# EAGLE design BRD170321 (EAGLE 7.6.0)
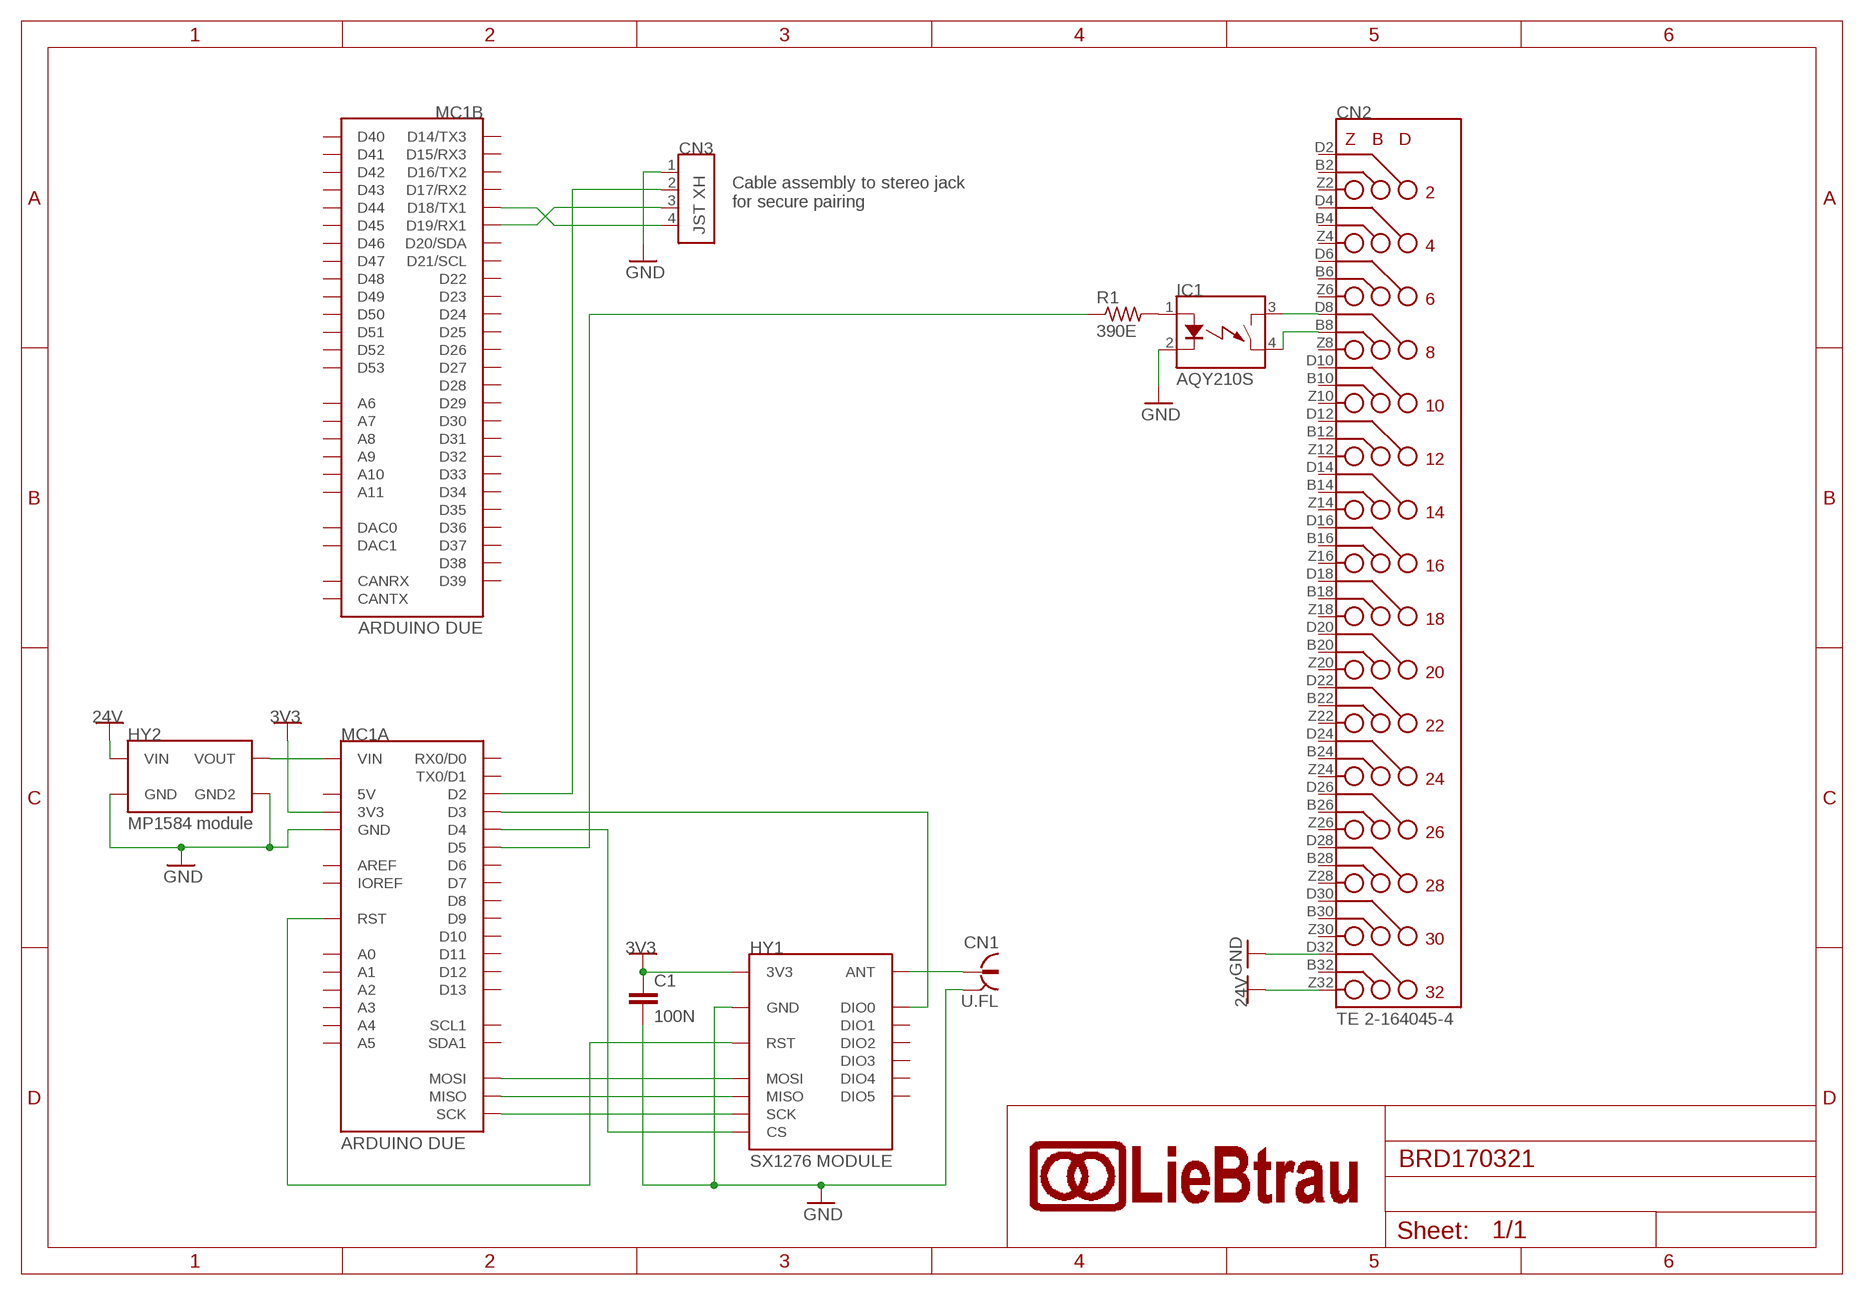
[diagram p0: schematic, sheet 1]
U$1 (SY_FRAMEA4): REV: R00.0x; TITLE: Garage controller

## Parts
C1  100N  CA_100N_1206  [CA_1206]
CN1  U.FL  CN_COAX_UMC_IPEX_U.FL_MALE  [CN_RF_U.FL_MALE]
CN2  TE 2-164045-4  CN_DIN41612F_HDR_90D_  [CN_HDR_DIN41612F_90D]
CN3  JST XH  CN_4P_JST_B4B-XH_JST_B4B-XH  [CN_HDR_1X4_180D_P25_JST_B4B-XH]
HY1  SX1276 MODULE  HY_SX1276  [HY_SX1276]
HY2  MP1584 module  HY_DCDC_MP1584_MP1584  [HY_MP1584]
IC1  AQY210S  IC_RELAY_SSR_NO_AQY210SX_SO6_4  [SC_SO6_P4]
MC1  ARDUINO DUE  MC_ARDUINO_DUE  [MC_ARDUINO_DUE]
R1  390E  RE_390E_1206  [RE_1206]

## Nets
3V3: C1.1 HY1.VCC(3V3) MC1.3.3V(A:3V3)
24V: CN2.Z32(32Z) HY2.IN+(VIN)
GND: C1.2 CN1.2A(OUTER) CN1.2B(OUTER) CN2.D32(32D) CN3.1 HY1.GND HY1.GND@1(GND) HY1.GND@2(GND) HY2.IN-(GND) HY2.OUT-(GND2) IC1.2(C) MC1.GND@1(A:GND) MC1.GND@2(A:GND) MC1.GND@3(A:GND) MC1.GND@4(A:GND) MC1.GND@5(A:GND) MC1.GND@6(A:GND)
N$1: IC1.1(A) R1.2
N$2: CN1.1(INNER) HY1.ANT
N$3: HY1.MOSI MC1.MOSI(A:MOSI)
N$4: HY2.OUT+(VOUT) MC1.VIN(A:VIN)
N$5: CN2.D8(8D) IC1.3(D1)
N$6: CN2.B8(8B) IC1.4(D2)
N$7: MC1.5(A:D5) R1.1
N$8: HY1.MISO MC1.MISO(A:MISO)
N$9: HY1.SCK MC1.SCK(A:SCK)
N$10: HY1.NSS(CS) MC1.4(A:D4)
N$11: HY1.DIO0 MC1.3(A:D3)
N$12: HY1.REST(RST) MC1.RESET(A:RST) MC1.RESET@2(A:RST)
N$13: CN3.2 MC1.2(A:D2)
N$14: CN3.3 MC1.19(B:D19/RX1)
N$15: CN3.4 MC1.18(B:D18/TX1)
Unconnected: CN2.B2(2B) CN2.B4(4B) CN2.B6(6B) CN2.B10(10B) CN2.B12(12B) CN2.B14(14B) CN2.B16(16B) CN2.B18(18B) CN2.B20(20B) CN2.B22(22B) CN2.B24(24B) CN2.B26(26B) CN2.B28(28B) CN2.B30(30B) CN2.B32(32B) CN2.D2(2D) CN2.D4(4D) CN2.D6(6D) CN2.D10(10D) CN2.D12(12D) CN2.D14(14D) CN2.D16(16D) CN2.D18(18D) CN2.D20(20D) CN2.D22(22D) CN2.D24(24D) CN2.D26(26D) CN2.D28(28D) CN2.D30(30D) CN2.Z2(2Z) CN2.Z4(4Z) CN2.Z6(6Z) CN2.Z8(8Z) CN2.Z10(10Z) CN2.Z12(12Z) CN2.Z14(14Z) CN2.Z16(16Z) CN2.Z18(18Z) CN2.Z20(20Z) CN2.Z22(22Z) CN2.Z24(24Z) CN2.Z26(26Z) CN2.Z28(28Z) CN2.Z30(30Z) HY1.DIO1 HY1.DIO2 HY1.DIO3 HY1.DIO4 HY1.DIO5 MC1.0(A:RX0/D0) MC1.1(A:TX0/D1) MC1.5V@1(A:5V) MC1.5V@2(A:5V) MC1.5V@3(A:5V) MC1.5V@4(A:5V) MC1.6(A:D6) MC1.7(A:D7) MC1.8(A:D8) MC1.9(A:D9) MC1.10(A:D10) MC1.11(A:D11) MC1.12(A:D12) MC1.13(A:D13) MC1.14(B:D14/TX3) MC1.15(B:D15/RX3) MC1.16(B:D16/TX2) MC1.17(B:D17/RX2) MC1.20(B:D20/SDA) MC1.21(B:D21/SCL) MC1.22(B:D22) MC1.23(B:D23) MC1.24(B:D24) MC1.25(B:D25) MC1.26(B:D26) MC1.27(B:D27) MC1.28(B:D28) MC1.29(B:D29) MC1.30(B:D30) MC1.31(B:D31) MC1.32(B:D32) MC1.33(B:D33) MC1.34(B:D34) MC1.35(B:D35) MC1.36(B:D36) MC1.37(B:D37) MC1.38(B:D38) MC1.39(B:D39) MC1.40(B:D40) MC1.41(B:D41) MC1.42(B:D42) MC1.43(B:D43) MC1.44(B:D44) MC1.45(B:D45) MC1.46(B:D46) MC1.47(B:D47) MC1.48(B:D48) MC1.49(B:D49) MC1.50(B:D50) MC1.51(B:D51) MC1.52(B:D52) MC1.53(B:D53) MC1.A0(A:A0) MC1.A1(A:A1) MC1.A2(A:A2) MC1.A3(A:A3) MC1.A4(A:A4) MC1.A5(A:A5) MC1.A6(B:A6) MC1.A7(B:A7) MC1.A8(B:A8) MC1.A9(B:A9) MC1.A10(B:A10) MC1.A11(B:A11) MC1.AREF(A:AREF) MC1.CANRX(B:CANRX) MC1.CANTX(B:CANTX) MC1.DAC0(B:DAC0) MC1.DAC1(B:DAC1) MC1.IOREF(A:IOREF) MC1.SCL1(A:SCL1) MC1.SDA1(A:SDA1)

## Notes on the sheet
- Cable assembly to stereo jack
  for secure pairing

## Library data of the parts
C1 = lieBtrau:CA; COST: 0.09; ORDERCODE: 399-1249-1-ND
CN1 = lieBtrau:CN_COAX; COST: 0.69; ORDERCODE: WM5587CT-ND
CN2 = lieBtrau:CN_DIN41612F; COST: 4.81; ORDERCODE: RS 681-1777
CN3 = lieBtrau:CN_4P; COST: 0.19; ORDERCODE: 455-2249-ND
HY1 = lieBtrau:HY_SX1276: Order from AliExpress <https://www.aliexpress.com/item/2-pcs-LOra-Spreading-High-Sensitivity-XL1276-D01-XS1278-Wireless-Transceiver-Module-433MHz/32322666735.html>; COST: 7.28; ORDERCODE: AliExpress
HY2 = lieBtrau:HY_DCDC: SX1308 Module: no identifiable clone of western ic AliExpress cheap module <https://www.aliexpress.com/item/DC-DC-SX1308-Step-UP-Adjustable-Power-Module-Boost-Converter/32642837831.html> AliExpress good pix module <https://www.aliexpress.com/item-img/10pcs-lot-Free-shipping-High-Current-2A-DC-DC-SX1308-adjustable-boost-module/32518786494.html> Original module: Shenzen LC Technology Co.,Ltd. <http://www.chinalctech.com/index.php?_m=mod_product&_a=view&p_id=1046> MP1584 Module: LM2596 clone AliExpress 5pcs. <https://www.aliexpress.com/item/5PCS-XM1584-Ultra-small-size-DC-DC-step-down-power-supply-module-3A-adjustable-step-down/32546853828.html>; COST: 0.39; ORDERCODE: AliExpress
IC1 = lieBtrau:IC_RELAY_SSR_NO; COST: 1.94; ORDERCODE: DK 255-2144-1-ND
MC1 = lieBtrau:MC_ARDUINO_DUE
R1 = lieBtrau:RE: Yageo RC1206 Stackpole RMCF1206; COST: 0.09; ORDERCODE: 311-390FRCT-ND

## Board
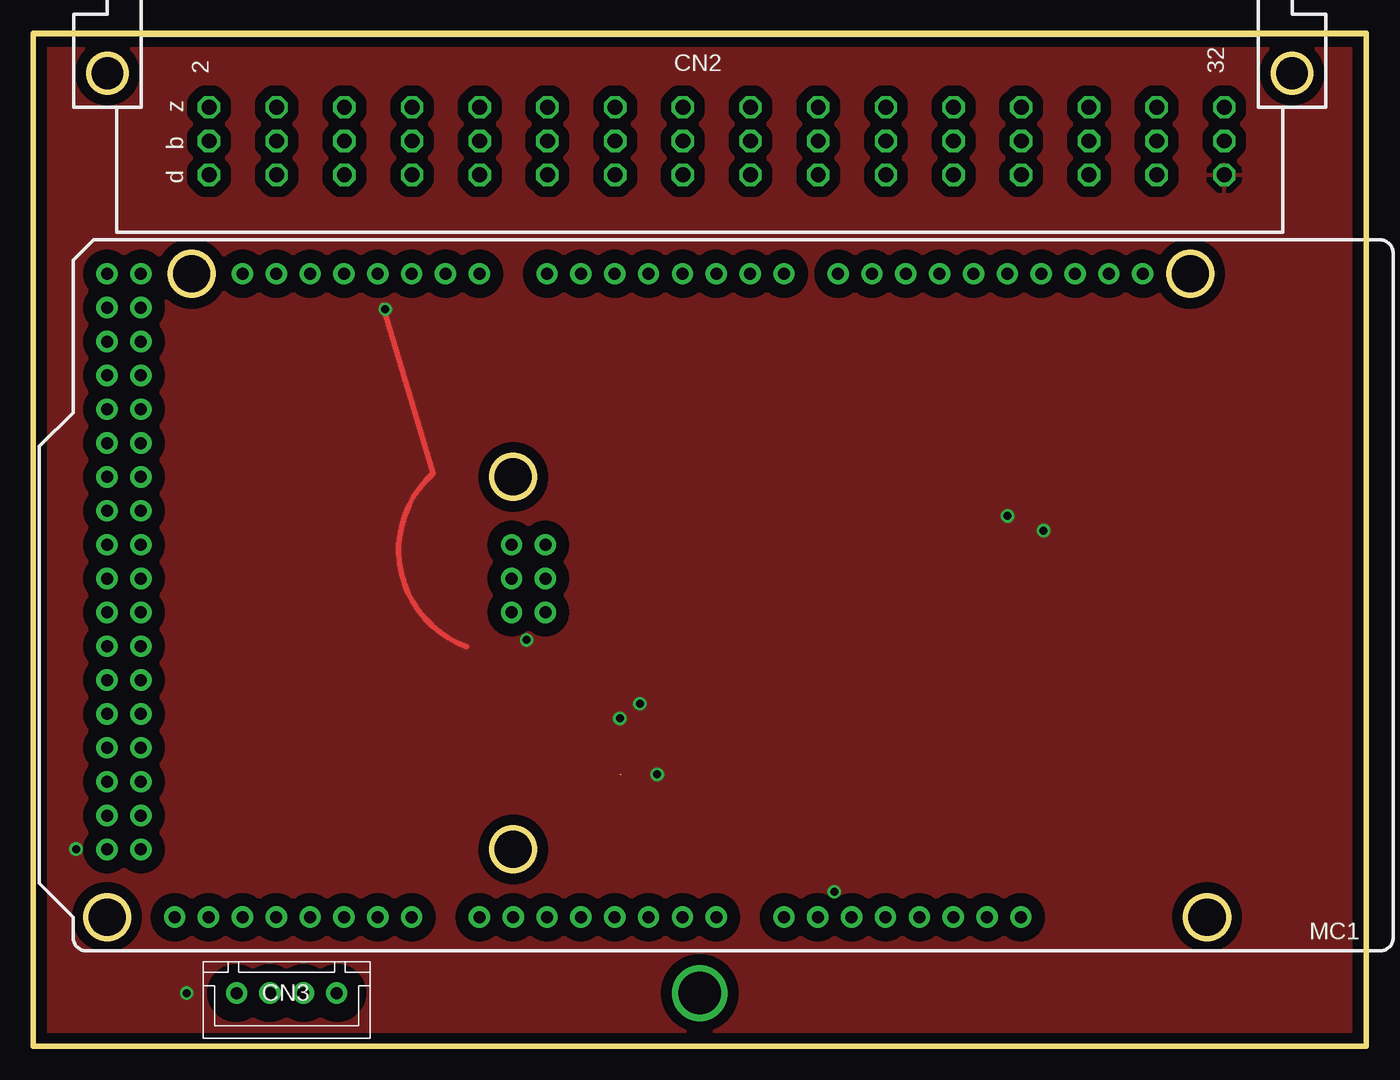
[diagram p1: board, top side]
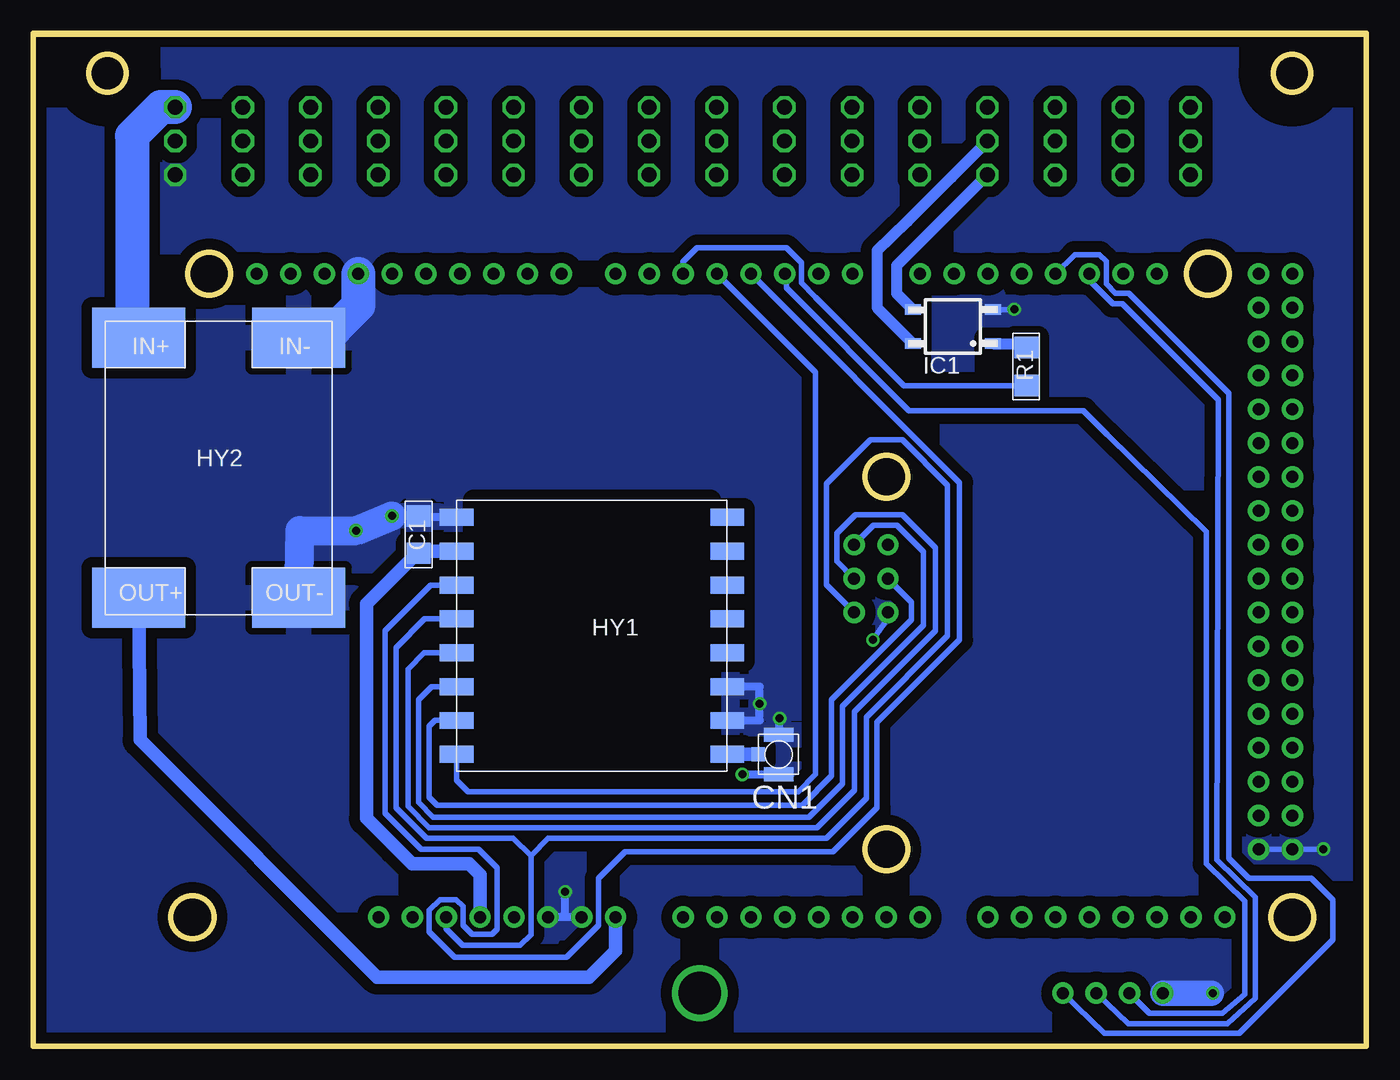
[diagram p2: board, bottom side, seen from below]

Size 100.03 x 76 mm. Coordinates in mm from the lower left corner, seen from the top.
Outline: 0.01,0 100.01,0 100.01,76 0.01,76 0.01,0
Copper layers (1*16): Top 0.035mm / dielectric 1.5mm / Bottom 0.035mm
Design rules "dtron": minimum track width 0.175mm, minimum drill 0.6mm, track to track 0.25mm, track to pad 0.25mm, pad to pad 0.2mm, via to via 0.25mm, smd to smd 0.2mm, copper to edge 0.5mm, drill to drill 0.2mm, minimum pad ring 0.25mm, minimum via ring 0.2mm, stop-mask expansion 0.1mm, vias tented up to drill 0mil, thermal gap 0.5mm
tKeepout: area 0,0 to 2,76; area 98,0 to 100,76
bKeepout: area 0,0 to 2,76; area 98,0 to 100,76

### Footprints (pad centres in the part's own frame; a part is rotated, then mirrored left to right if it is on the bottom)
CA_1206 = smd 1.6 x 1.8: 1 -1.4,0; 2 1.4,0
CN_RF_U.FL_MALE = smd 1.05 x 1: 1 0,-1.52 | smd 1.05 x 2.2: 2A -1.47,0; 2B 1.47,0
CN_HDR_DIN41612F_90D = drill 1.118 octagon: B2 -5.08,36.83; B4 -5.08,31.75; B6 -5.08,26.67; B8 -5.08,21.59; B10 -5.08,16.51; B12 -5.08,11.43; B14 -5.08,6.35; B16 -5.08,1.27; B18 -5.08,-3.81; B20 -5.08,-8.89; B22 -5.08,-13.97; B24 -5.08,-19.05; B26 -5.08,-24.13; B28 -5.08,-29.21; B30 -5.08,-34.29; B32 -5.08,-39.37; D2 -7.62,36.83; D4 -7.62,31.75; D6 -7.62,26.67; D8 -7.62,21.59; D10 -7.62,16.51; D12 -7.62,11.43; D14 -7.62,6.35; D16 -7.62,1.27; D18 -7.62,-3.81; D20 -7.62,-8.89; D22 -7.62,-13.97; D24 -7.62,-19.05; D26 -7.62,-24.13; D28 -7.62,-29.21; D30 -7.62,-34.29; D32 -7.62,-39.37; Z2 -2.54,36.83; Z4 -2.54,31.75; Z6 -2.54,26.67; Z8 -2.54,21.59; Z10 -2.54,16.51; Z12 -2.54,11.43; Z14 -2.54,6.35; Z16 -2.54,1.27; Z18 -2.54,-3.81; Z20 -2.54,-8.89; Z22 -2.54,-13.97; Z24 -2.54,-19.05; Z26 -2.54,-24.13; Z28 -2.54,-29.21; Z30 -2.54,-34.29; Z32 -2.54,-39.37 | hole 2.794: 0,44.45; 0,-44.45
CN_HDR_1X4_180D_P25_JST_B4B-XH = drill 0.9 pad 1.6: 1 -3.75,0; 2 -1.25,0; 3 1.25,0; 4 3.75,0
HY_SX1276 = smd 2.54 x 1.27: ANT -10.16,8.89; DIO0 10.16,-3.81; DIO1 -10.16,1.27; DIO2 -10.16,-1.27; DIO3 -10.16,-3.81; DIO4 -10.16,-6.35; DIO5 -10.16,-8.89; GND 10.16,-8.89; GND@1 -10.16,6.35; GND@2 -10.16,3.81; MISO 10.16,3.81; MOSI 10.16,6.35; NSS 10.16,8.89; REST 10.16,-1.27; SCK 10.16,1.27; VCC 10.16,-6.35
HY_MP1584 = smd 4.5 x 7: IN+ -9.75,-6; IN- -9.75,6; OUT+ 9.75,-6; OUT- 9.75,6
SC_SO6_P4 = smd 0.8 x 1.2: 1 -1.27,-3; 2 1.27,-3; 3 1.27,3; 4 -1.27,3
MC_ARDUINO_DUE = drill 0.9 pad 1.6: 0 -63.5,50.8; 1 -60.96,50.8; 2 -58.42,50.8; 3 -55.88,50.8; 3.3V -35.56,2.54; 4 -53.34,50.8; 5 -50.8,50.8; 5V@1 -38.1,2.54; 5V@2 -93.98,50.8; 5V@3 -96.52,50.8; 5V@4 -66.167,30.48; 6 -48.26,50.8; 7 -45.72,50.8; 8 -41.656,50.8; 9 -39.116,50.8; 10 -36.576,50.8; 11 -34.036,50.8; 12 -31.496,50.8; 13 -28.956,50.8; 14 -68.58,50.8; 15 -71.12,50.8; 16 -73.66,50.8; 17 -76.2,50.8; 18 -78.74,50.8; 19 -81.28,50.8; 20 -83.82,50.8; 21 -86.36,50.8; 22 -93.98,48.26; 23 -96.52,48.26; 24 -93.98,45.72; 25 -96.52,45.72; 26 -93.98,43.18; 27 -96.52,43.18; 28 -93.98,40.64; 29 -96.52,40.64; 30 -93.98,38.1; 31 -96.52,38.1; 32 -93.98,35.56; 33 -96.52,35.56; 34 -93.98,33.02; 35 -96.52,33.02; 36 -93.98,30.48; 37 -96.52,30.48; 38 -93.98,27.94; 39 -96.52,27.94; 40 -93.98,25.4; 41 -96.52,25.4; 42 -93.98,22.86; 43 -96.52,22.86; 44 -93.98,20.32; 45 -96.52,20.32; 46 -93.98,17.78; 47 -96.52,17.78; 48 -93.98,15.24; 49 -96.52,15.24; 50 -93.98,12.7; 51 -96.52,12.7; 52 -93.98,10.16; 53 -96.52,10.16; A0 -50.8,2.54; A1 -53.34,2.54; A2 -55.88,2.54; A3 -58.42,2.54; A4 -60.96,2.54; A5 -63.5,2.54; A6 -66.04,2.54; A7 -68.58,2.54; A8 -73.66,2.54; A9 -76.2,2.54; A10 -78.74,2.54; A11 -81.28,2.54; AREF -23.876,50.8; CANRX -88.9,2.54; CANTX -91.44,2.54; DAC0 -83.82,2.54; DAC1 -86.36,2.54; GND@1 -40.64,2.54; GND@2 -43.18,2.54; GND@3 -96.52,7.62; GND@4 -93.98,7.62; GND@5 -66.167,25.4; GND@6 -26.416,50.8; IOREF -30.48,2.54; MISO -63.627,30.48; MOSI -66.167,27.94; NC -27.94,2.54; RESET -33.02,2.54; RESET@2 -63.627,25.4; SCK -63.627,27.94; SCL1 -18.796,50.8; SDA1 -21.336,50.8; VIN -45.72,2.54 | hole 3.2: -15.24,50.8; -90.17,50.8; -96.52,2.54; -66.04,35.56; -13.97,2.54; -66.04,7.62
RE_1206 = smd 1.6 x 1.803: 1 -1.422,0; 2 1.422,0

### Placement (x,y rotation side)
C1  71.11,38.4 90 bottom
CN1  44.09,21.9 270 bottom
CN2  50.01,73 90 top
CN3  19.01,4 0 top
DRILEGEND  [DRILEGEND]  107.54,73.36 0 top  (outside the outline)
HY1  58.11,30.8 180 bottom
HY2  86.11,43.4 270 bottom
IC1  31.01,54 90 bottom
MC1  102.05,7.16 0 top
R1  25.51,51 90 bottom
U$6  [MC_FRAME_A5]  -38.89,-35.7 0 top  (outside the outline)

### Tracks (layer width: path | path; a pad name or v marks a point on that pad's centre or on a via)
3V3
  Bottom 1.016: HY1.VCC 71.06,37.15 71.21,37 | 71.21,37 75.01,33.2 75.01,17.1 72.81,14.9 71.61,13.7 67.31,13.7 66.49,12.88 MC1.3.3V | C1.1 71.21,37
24V
  Bottom 2.54: CN2.Z32 90.45,70.46 92.61,68.3 92.61,54.1 92.36,54.1 HY2.IN+
GND  (via drill 0.6)  (1 unrouted)
  Top 0.406: 26.21,55.6 30.01,43 arc119 32.51,30
  Bottom 0.406: MC1.GND@3 MC1.GND@4 6.81,14.78 v3.21,14.8 | 45.51,27 45.51,25.6 | IC1.2 26.44,55.27 v26.41,55.3 | MC1.GND@5 35.89,32.13 v37.01,30.5
  Bottom 0.61: HY1.GND@1 45.51,24.45 45.51,25.6 v45.51,25.7 45.51,27 HY1.GND@2 | CN1.2A 44.01,23.37 v44.01,24.6 | v46.81,20.4 44.01,20.4 | MC1.GND@1 MC1.GND@2 60.11,9.7 v60.11,11.6 | HY1.GND 71.11,39.69 C1.2 v73.11,39.8
  Bottom 1.93: CN3.1 11.61,4
  Bottom 2.184: HY2.OUT- 80.01,38.7 v75.81,38.7 v73.11,39.8
  Bottom 2.54: MC1.GND@6 75.64,55.58 77.41,53.8 | 79.96,53.8 HY2.IN-
  other vias: 11.51,4
  pour Bottom (isolate 0.813): -15.49,90.5 -15.49,-8.5 125.51,-8.5 125.51,90.5
  pour Top (isolate 0.813): -8.99,86.5 -8.99,-8.5 113.01,-8.5 113.01,86.5
N$1
  Bottom 0.813: IC1.1 25.82,52.73 R1.2
N$2
  Bottom 1.016: CN1.1 HY1.ANT
N$3
  Bottom 0.406: HY1.MOSI 69.86,24.45 70.31,24 70.31,18.7 69.71,18.1 42.31,18.1 40.11,20.3 40.11,26 34.11,32 34.11,33.33 MC1.MOSI
N$4
  Bottom 1.016: HY2.OUT+ 92.01,23 74.21,5.2 58.31,5.2 56.33,7.18 MC1.VIN
N$5
  Bottom 0.813: CN2.D8 31.8,62 32.01,61.8 35.24,58.57 35.24,56.5 IC1.3
N$6
  Bottom 0.813: CN2.B8 31.01,65.33 31.11,65.2 34.41,61.9 36.71,59.7 36.71,55.43 IC1.4
N$7
  Bottom 0.406: MC1.5 51.25,58.86 50.21,59.9 43.51,59.9 42.37,58.79 42.37,57.29 41.31,56.2 34.69,49.58 R1.1
N$8
  Bottom 0.406: HY1.MISO 70.12,26.99 71.11,26 71.11,18.3 70.01,17.2 41.81,17.2 39.31,19.7 39.31,25.5 33.21,31.6 33.21,37.1 35.21,39.1 36.97,39.1 MC1.MISO
N$9
  Bottom 0.406: HY1.SCK 70.68,29.53 71.91,28.3 71.91,18 70.31,16.4 41.21,16.4 38.41,19.2 38.41,25.1 32.31,31.2 32.31,37.4 34.81,39.9 38.31,39.9 39.71,38.5 39.71,36.39 MC1.SCK
N$10
  Bottom 0.406: HY1.NSS 68.27,19.96 67.41,19.1 42.61,19.1 41.31,20.4 41.31,50.56 MC1.4
N$11
  Bottom 0.406: HY1.DIO0 70.2,34.61 73.61,31.2 73.61,17.5 70.91,14.8 66.61,14.8 65.21,13.4 65.21,8.8 65.61,8.4 67.11,8.4 67.76,9.1 67.76,10.5 68.31,11 69.51,11 70.31,10.2 70.31,8.6 68.41,6.7 60.01,6.7 57.61,9.1 57.61,12.6 55.61,14.6 40.01,14.6 36.71,17.9 36.71,24.3 30.51,30.5 30.51,42.3 MC1.3 45.97,57.96
N$12
  Bottom 0.406: HY1.REST 70.64,32.07 72.81,29.9 72.81,17.9 70.51,15.6 64.01,15.6 62.68,14.29 | MC1.RESET 69.03,8.82 67.81,7.6 63.51,7.6 62.68,8.39 62.68,14.29 | 62.68,14.29 61.41,15.6 40.51,15.6 37.51,18.6 37.51,24.7 31.41,30.8 31.41,42.1 34.81,45.5 37.21,45.5 40.51,42.2 40.51,34.65 MC1.RESET@2
N$13
  Bottom 0.406: CN3.2 16.26,2.5 10.81,2.5 9.11,3.9 9.11,10.9 12.01,13.7 12.01,38.6 19.41,45.9 21.21,47.7 34.31,47.7 43.51,56.9 43.51,57.84 MC1.2
N$14
  Bottom 0.406: MC1.19 20.77,57.46 19.01,55.7 18.31,55.7 11.11,48.5 11.21,14 8.31,11.2 8.31,3.6 10.41,1.7 17.86,1.7 CN3.3
N$15
  Bottom 0.406: CN3.4 19.66,1 9.51,1 2.51,8 2.51,11 4.11,12.6 8.81,12.6 10.31,14.1 10.31,49 17.81,56.5 18.81,56.5 19.51,57.2 19.51,58.9 20.01,59.4 21.87,59.4 MC1.18
N$16  (via drill 3.2)
  other vias: 50.01,4